# Altium project 8LEDProject.PrjPcb
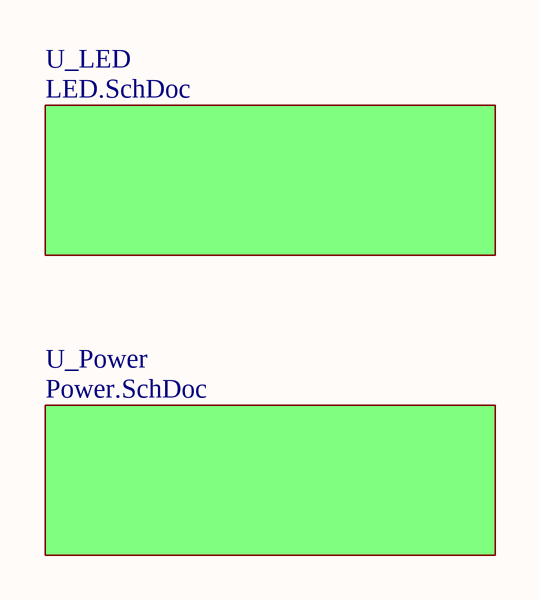
[diagram p0: all.SchDoc]
3 sheets, 40 parts. Net scope: global (net labels, ports and power ports of the same name join across sheets).
Board file: yhn.PcbDoc
Sheets:
  all.SchDoc
    U_LED = LED.SchDoc
    U_Power = Power.SchDoc

## Sheet all.SchDoc
size A4

### Sub-sheets
U_LED = LED.SchDoc: no entries
U_Power = Power.SchDoc: no entries

## Sheet LED.SchDoc
size A4
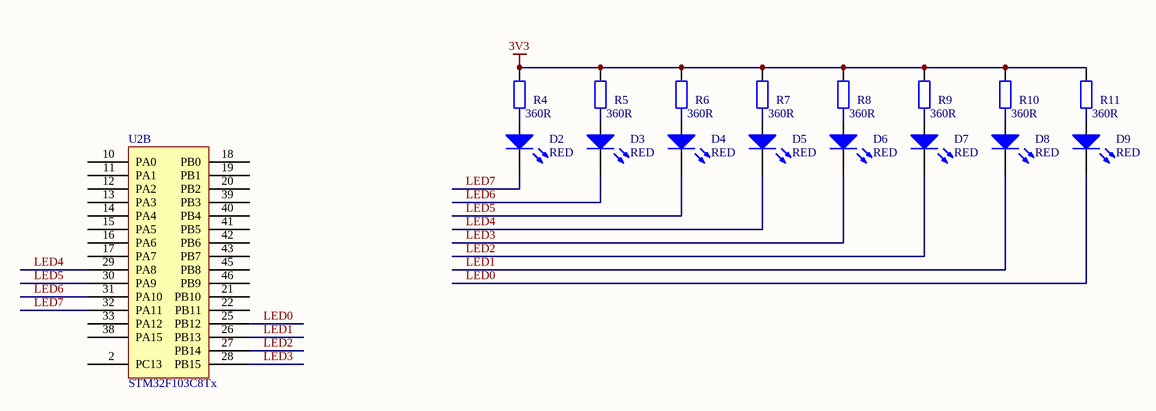
[diagram p1: LED.SchDoc]

### Parts
D2  RED  [LED0603-RED]
D3  RED  [LED0603-RED]
D4  RED  [LED0603-RED]
D5  RED  [LED0603-RED]
D6  RED  [LED0603-RED]
D7  RED  [LED0603-RED]
D8  RED  [LED0603-RED]
D9  RED  [LED0603-RED]
R4  value 360R  [R0603]
R5  value 360R  [R0603]
R6  value 360R  [R0603]
R7  value 360R  [R0603]
R8  value 360R  [R0603]
R9  value 360R  [R0603]
R10  value 360R  [R0603]
R11  value 360R  [R0603]
U2  STM32F103C8Tx  [PQFP48]  (part B of 2)

### Nets
3V3: R4.1 R5.1 R6.1 R7.1 R8.1 R9.1 R10.1 R11.1
LED0: D9.2(K) U2.25(PB12)
LED1: D8.2(K) U2.26(PB13)
LED2: D7.2(K) U2.27(PB14)
LED3: D6.2(K) U2.28(PB15)
LED4: D5.2(K) U2.29(PA8)
LED5: D4.2(K) U2.30(PA9)
LED6: D3.2(K) U2.31(PA10)
LED7: D2.2(K) U2.32(PA11)
NetD2_1: D2.1(A) R4.2
NetD3_1: D3.1(A) R5.2
NetD4_1: D4.1(A) R6.2
NetD5_1: D5.1(A) R7.2
NetD6_1: D6.1(A) R8.2
NetD7_1: D7.1(A) R9.2
NetD8_1: D8.1(A) R10.2
NetD9_1: D9.1(A) R11.2

Not connected (* = marked no-connect by the designer): U2 2(PC13) 10(PA0) 11(PA1) 12(PA2) 13(PA3) 14(PA4) 15(PA5) 16(PA6) 17(PA7) 18(PB0) 19(PB1) 20(PB2) 21(PB10) 22(PB11) 33(PA12) 38(PA15) 39(PB3) 40(PB4) 41(PB5) 42(PB6) 43(PB7) 45(PB8) 46(PB9)

### Library data of the parts
D2-D9 = LED0: Typical INFRARED GaAs LED; Published: 8-Jun-2000; LatestRevisionDate: 08-Jul-2005; LatestRevisionNote: Mech Layer 1 removed.; PackageReference: LED-0; Publisher: Altium Limited; PackageDescription: LED; 2 Leads
R4-R11 = Res2: Resistor; Published: 8-Jun-2000; LatestRevisionDate: 17-Jul-2002; LatestRevisionNote: Re-released for DXP Platform.; PackageReference: AXIAL-0.4; Publisher: Altium Limited; PackageDescription: Axial Device, Thru-Hole; 2 Leads; 0.4 in Pin Spacing

## Sheet Power.SchDoc
size A4
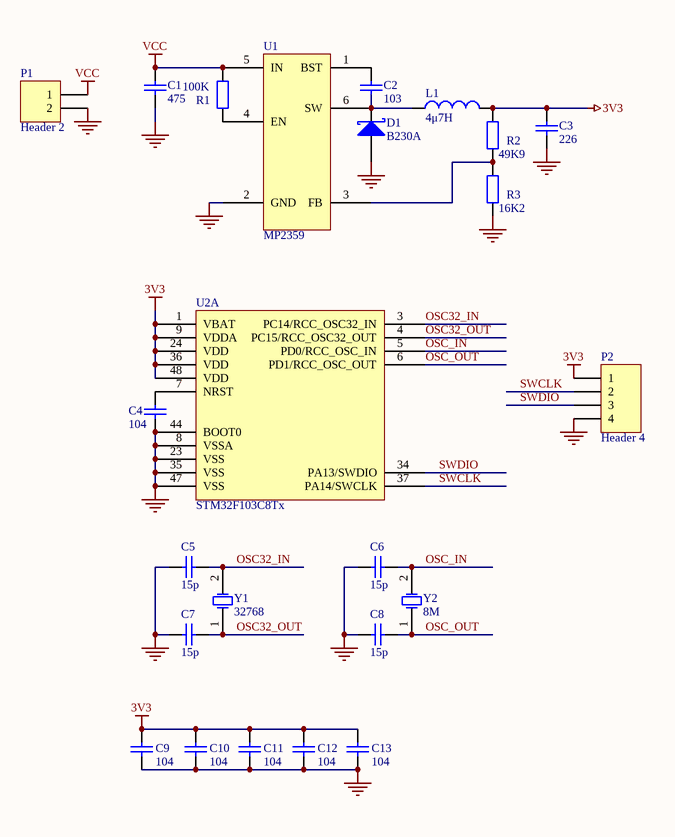
[diagram p2: Power.SchDoc]

### Parts
C1  475  [C1206]
C2  103  [C0603]
C3  226  [C0805]
C4  104  [C0603]
C5  15p  [C0603]
C6  15p  [C0603]
C7  15p  [C0603]
C8  15p  [C0603]
C9  104  [C0603]
C10  104  [C0603]
C11  104  [C0603]
C12  104  [C0603]
C13  104  [C0603]
D1  B230A  [SMA]
L1  value 4μ7H  [L4X4]
P1  Header 2  [XH2P54P2]
P2  Header 4  [SIP4]
R1  value 100K  [R0603]
R2  value 49K9  [R0603]
R3  value 16K2  [R0603]
U1  MP2359  [SOT23-6]
U2  STM32F103C8Tx  [PQFP48]  (part A of 2)
Y1  32768  [FC-135]
Y2  8M  [CY5032]

### Nets
3V3: C3.2 C9.2 C10.2 C11.2 C12.2 C13.2 L1.2 P2.1 R2.1 U2.1(VBAT) U2.9(VDDA) U2.24(VDD) U2.36(VDD) U2.48(VDD)
GND: C1.1 C3.1 C4.1 C5.2 C6.2 C7.2 C8.2 C9.1 C10.1 C11.1 C12.1 C13.1 D1.1(A) P1.2 P2.4 R3.2 U1.2(GND) U2.8(VSSA) U2.23(VSS) U2.35(VSS) U2.44(BOOT0) U2.47(VSS)
VCC: C1.2 P1.1 R1.1 U1.5(IN)
OSC32_IN: C5.1 U2.3(PC14/RCC_OSC32_IN) Y1.2(OSC2)
OSC32_OUT: C7.1 U2.4(PC15/RCC_OSC32_OUT) Y1.1(OSC1)
OSC_IN: C6.1 U2.5(PD0/RCC_OSC_IN) Y2.2(OSC2)
OSC_OUT: C8.1 U2.6(PD1/RCC_OSC_OUT) Y2.1(OSC1)
SWCLK: P2.2 U2.37(PA14/SWCLK)
SWDIO: P2.3 U2.34(PA13/SWDIO)
NetC2_1: C2.1 D1.2(K) L1.1 U1.6(SW)
NetC2_2: C2.2 U1.1(BST)
NetC4_2: C4.2 U2.7(NRST)
NetR1_2: R1.2 U1.4(EN)
NetR2_2: R2.2 R3.1 U1.3(FB)

### Library data of the parts
C1-C13 = Cap: Capacitor; Published: 8-Jun-2000; LatestRevisionDate: 17-Jul-2002; LatestRevisionNote: Re-released for DXP Platform.; PackageReference: RAD-0.3; Publisher: Altium Limited; PackageDescription: Radial Cap, Thru-Hole; 2 Leads; 0.3 in Pin Spacing
D1 = Diode BAS70: Silicon AF Schottky Diode for High-Speed Switching; Note: Pin 2 is not connected and not drawn.; Published: 21-Mar-2003; LatestRevisionDate: 29-May-2009; LatestRevisionNote: IPC-7351 Footprint Added.; DatasheetVersion: Oct-1999; PackageVersion: Sep-2001; PackageReference: SOT-23; Publisher: Altium Limited; PackageDescription: 3-Pin SOT-23 Package 0.95 mm Pitch, 2.5 mm Lead Span; ComponentLink1Description: Manufacturer Link; ComponentLink1URL: http://www.infineon.com/; ComponentLink2Description: Datasheet; ComponentLink2URL: http://www.infineon.com/upload/Document/cmc_upload/documents/009/382/bas40_bas140series_1.pdf
L1 = Inductor: Code_IEC: 1005; Published: 8-Jun-2000; LatestRevisionDate: 29-May-2009; LatestRevisionNote: IPC-7351 Footprint Added.; PackageReference: 0402-A; Publisher: Altium Limited; PackageDescription: Chip Inductor; Code_JEITA: 0402
P1 = Header 2H: Header, 2-Pin, Right Angle; LatestRevisionDate: 17-Jul-2002; LatestRevisionNote: Re-released for DXP Platform.; Publisher: Altium Limited
P2 = Header 4: Header, 4-Pin; LatestRevisionDate: 17-Jul-2002; LatestRevisionNote: Re-released for DXP Platform.; Publisher: Altium Limited
R1-R3 = Res2: Resistor; Published: 8-Jun-2000; LatestRevisionDate: 17-Jul-2002; LatestRevisionNote: Re-released for DXP Platform.; PackageReference: AXIAL-0.4; Publisher: Altium Limited; PackageDescription: Axial Device, Thru-Hole; 2 Leads; 0.4 in Pin Spacing
Y1 Y2 = XTAL: Crystal Oscillator; Published: 8-Jun-2000; LatestRevisionDate: 17-Jul-2002; LatestRevisionNote: Re-released for DXP Platform.; PackageReference: R38; Publisher: Altium Limited; PackageDescription: Crystal, Thru-Hole; 2 Leads; Body 3.1 x 8.2 mm (Dia.xH)

## Nets that join several sheets
3V3: LED (8 pins), Power (14 pins)